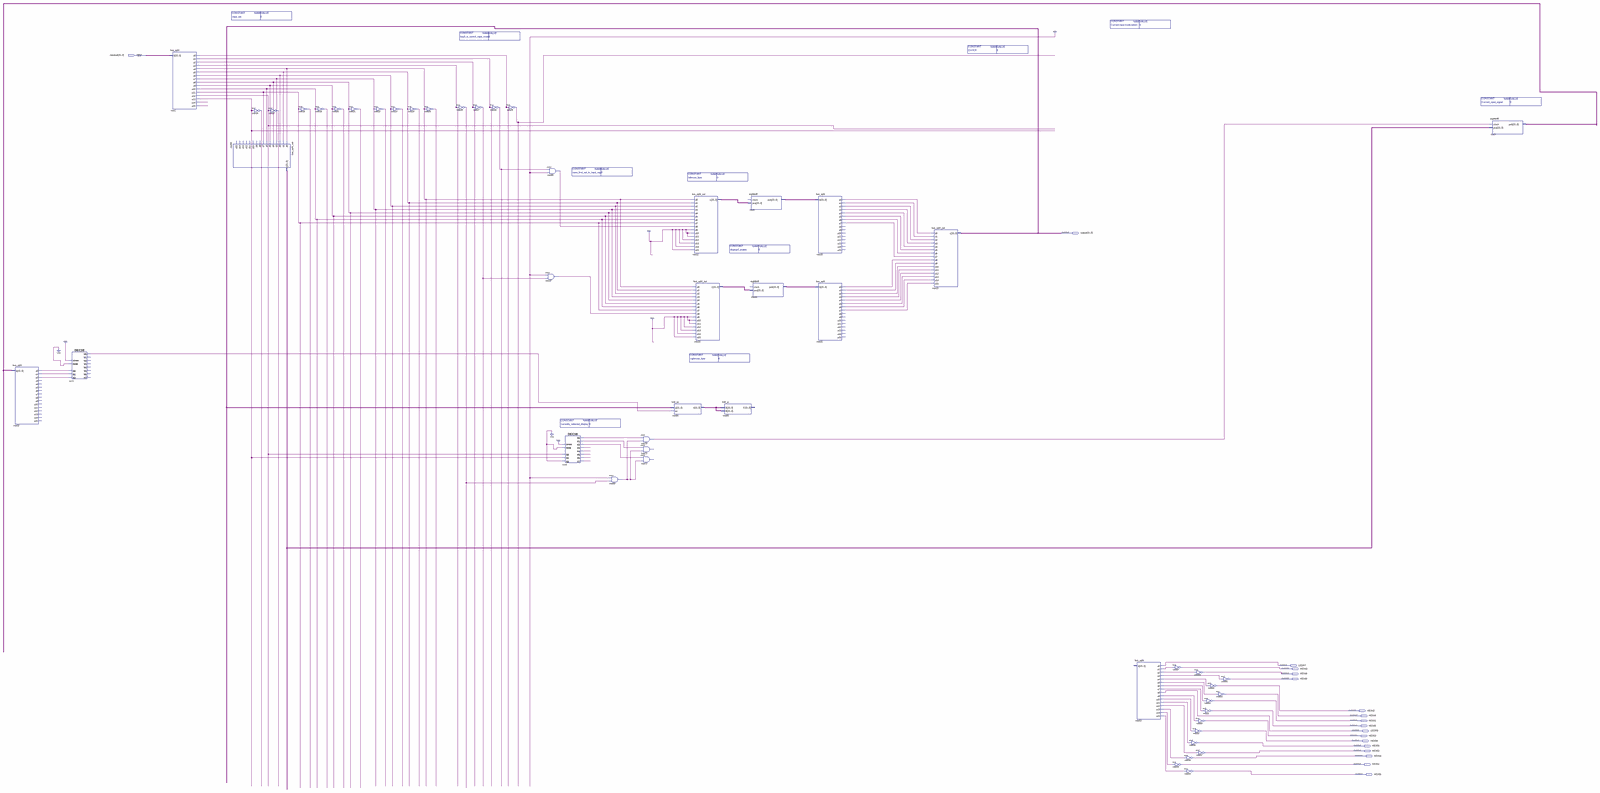
[diagram p0: schematic sheet, whole]
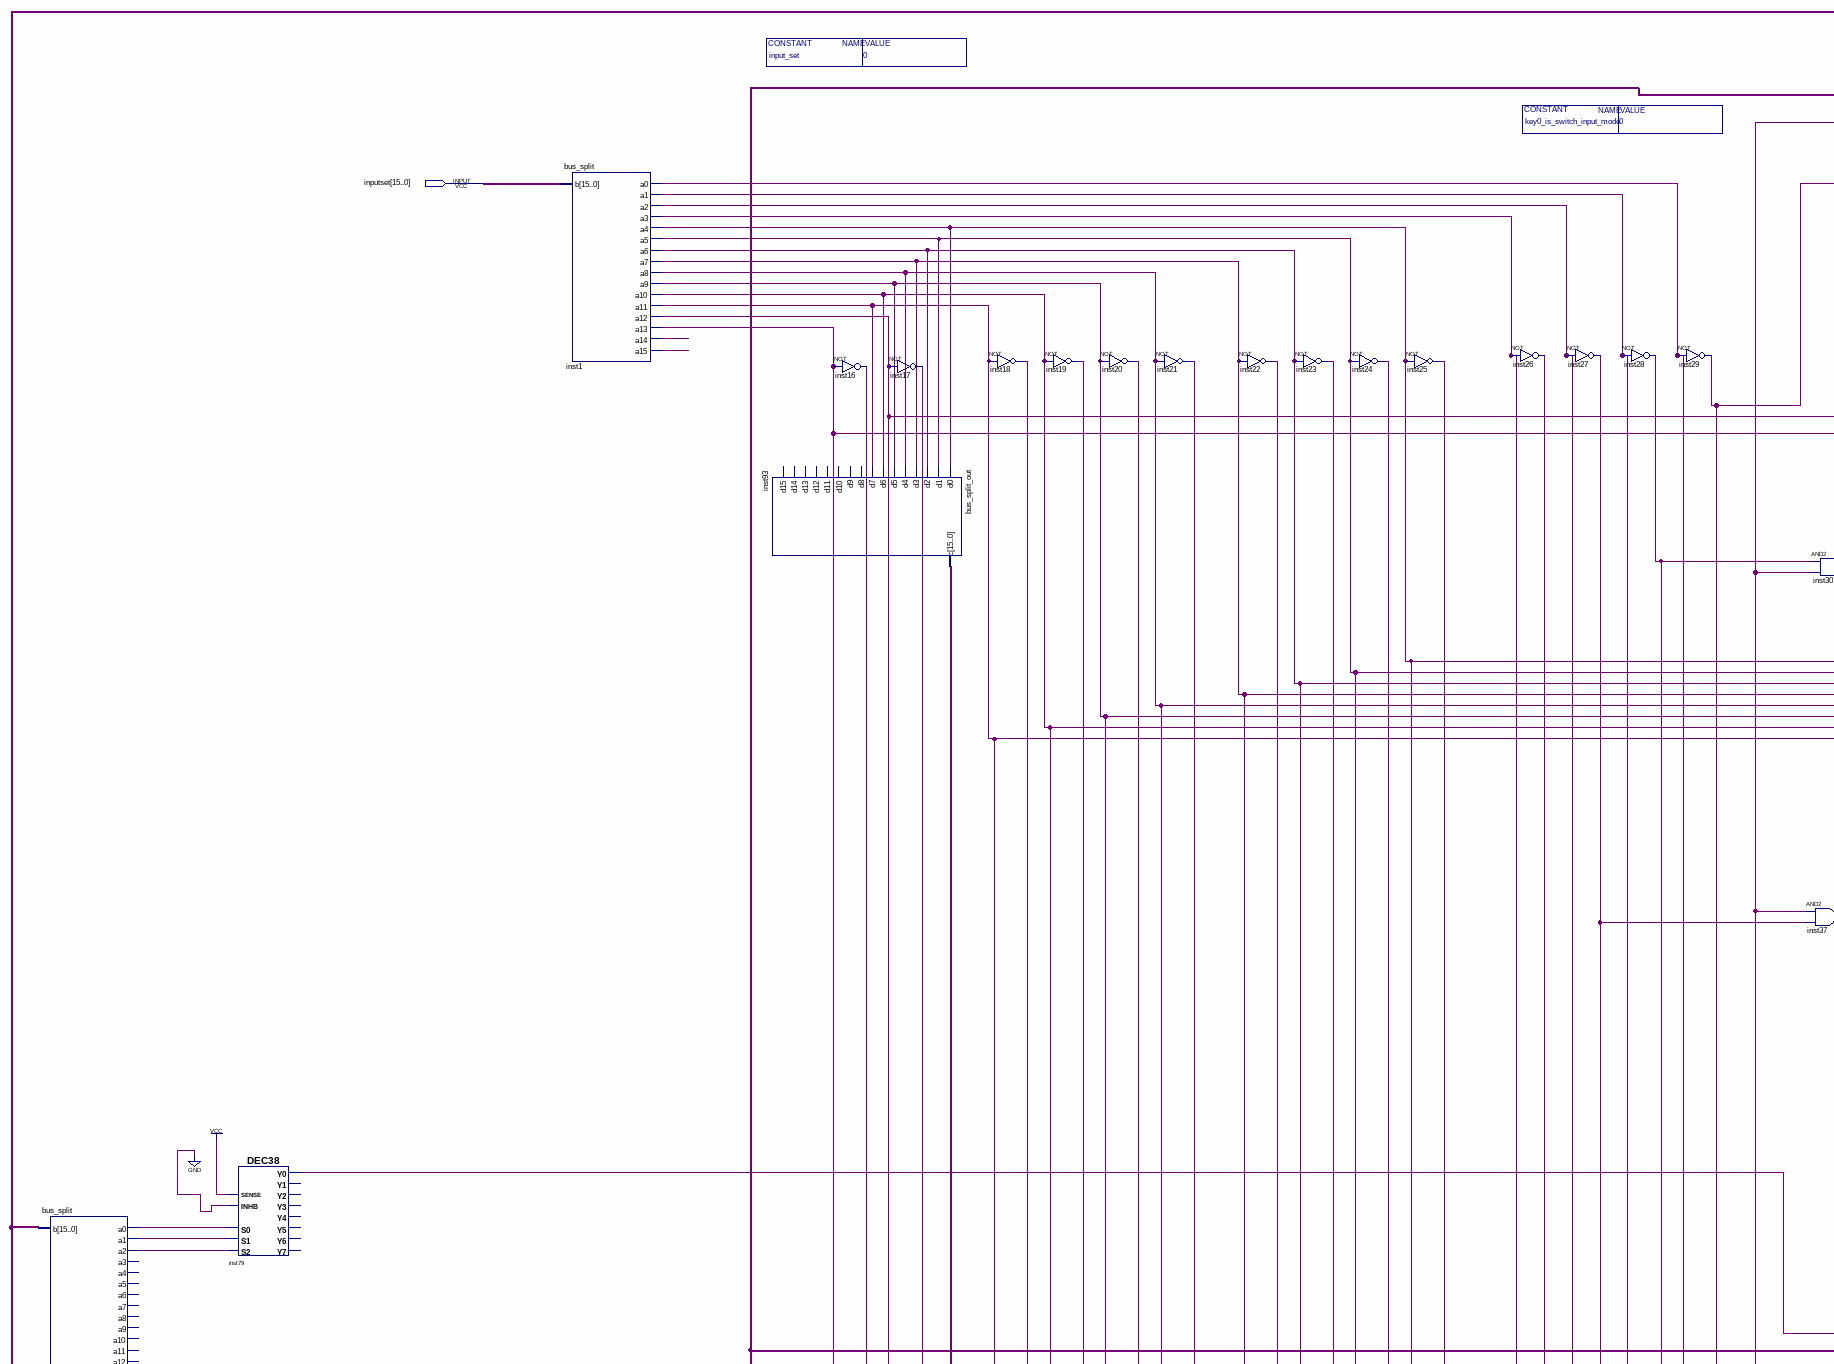
[diagram p1: schematic sheet, upper left part]
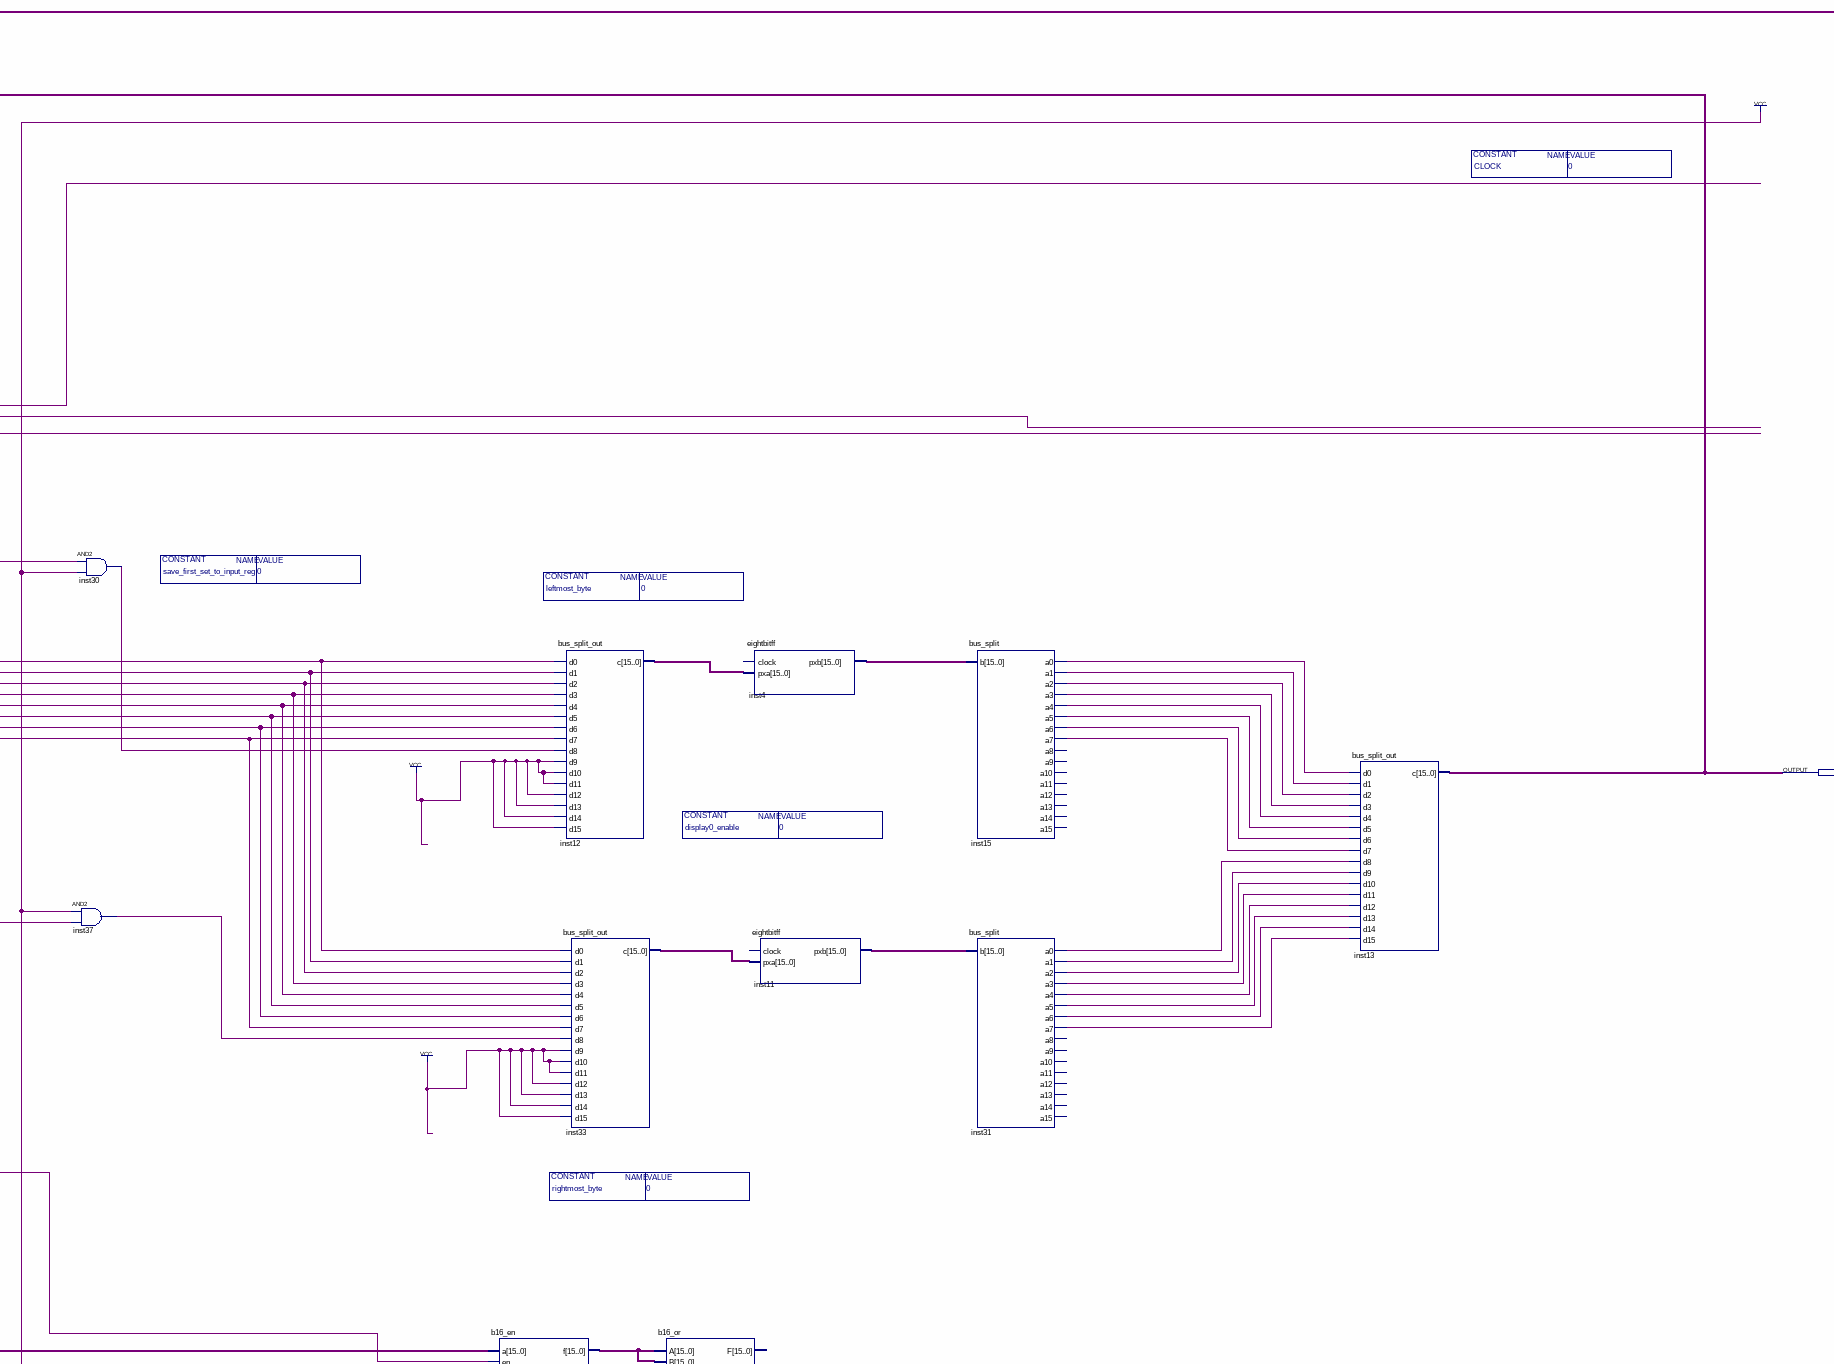
[diagram p2: schematic sheet, upper centre part]
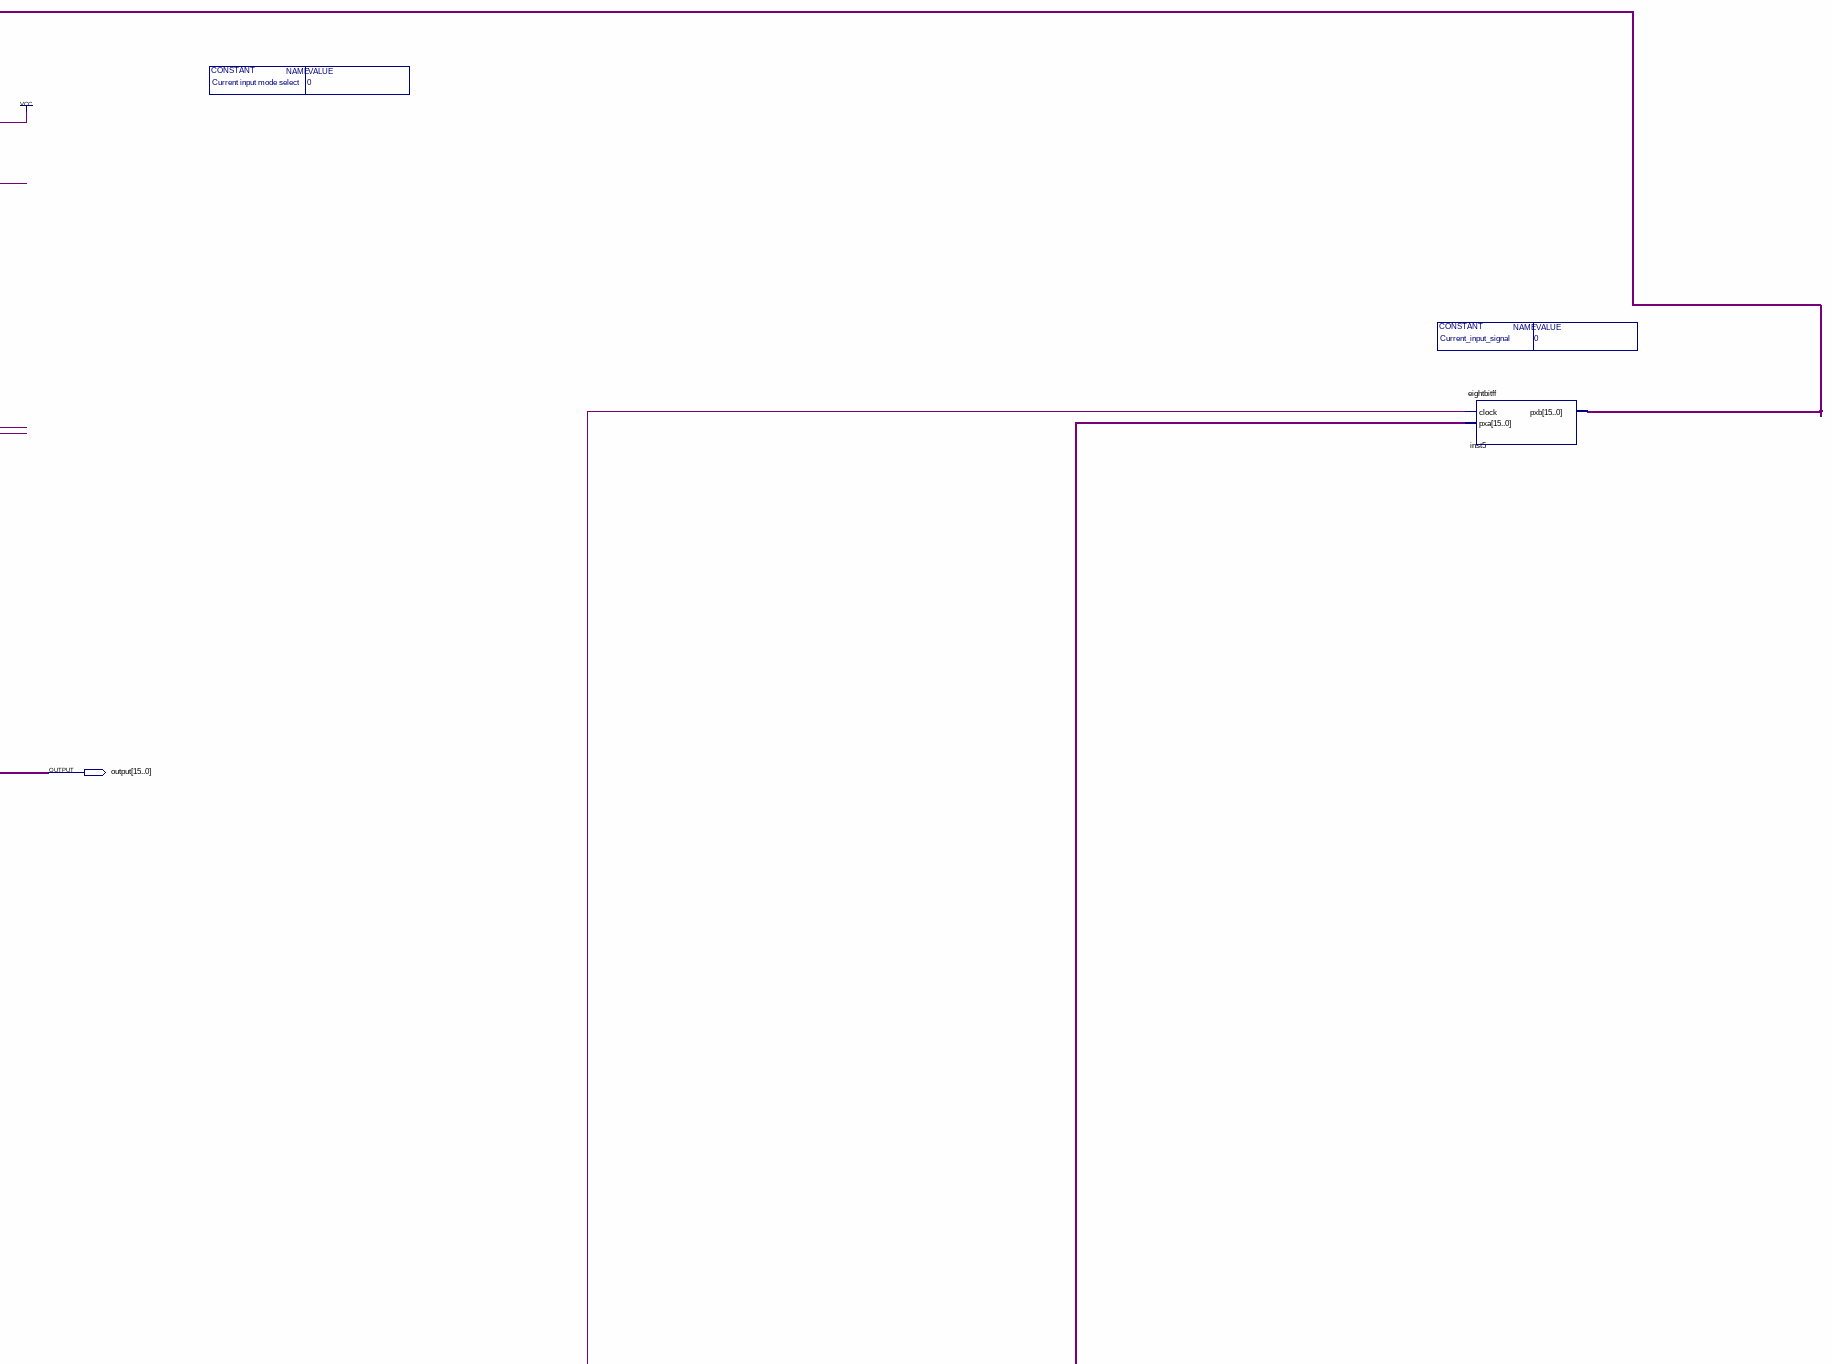
[diagram p3: schematic sheet, upper right part]
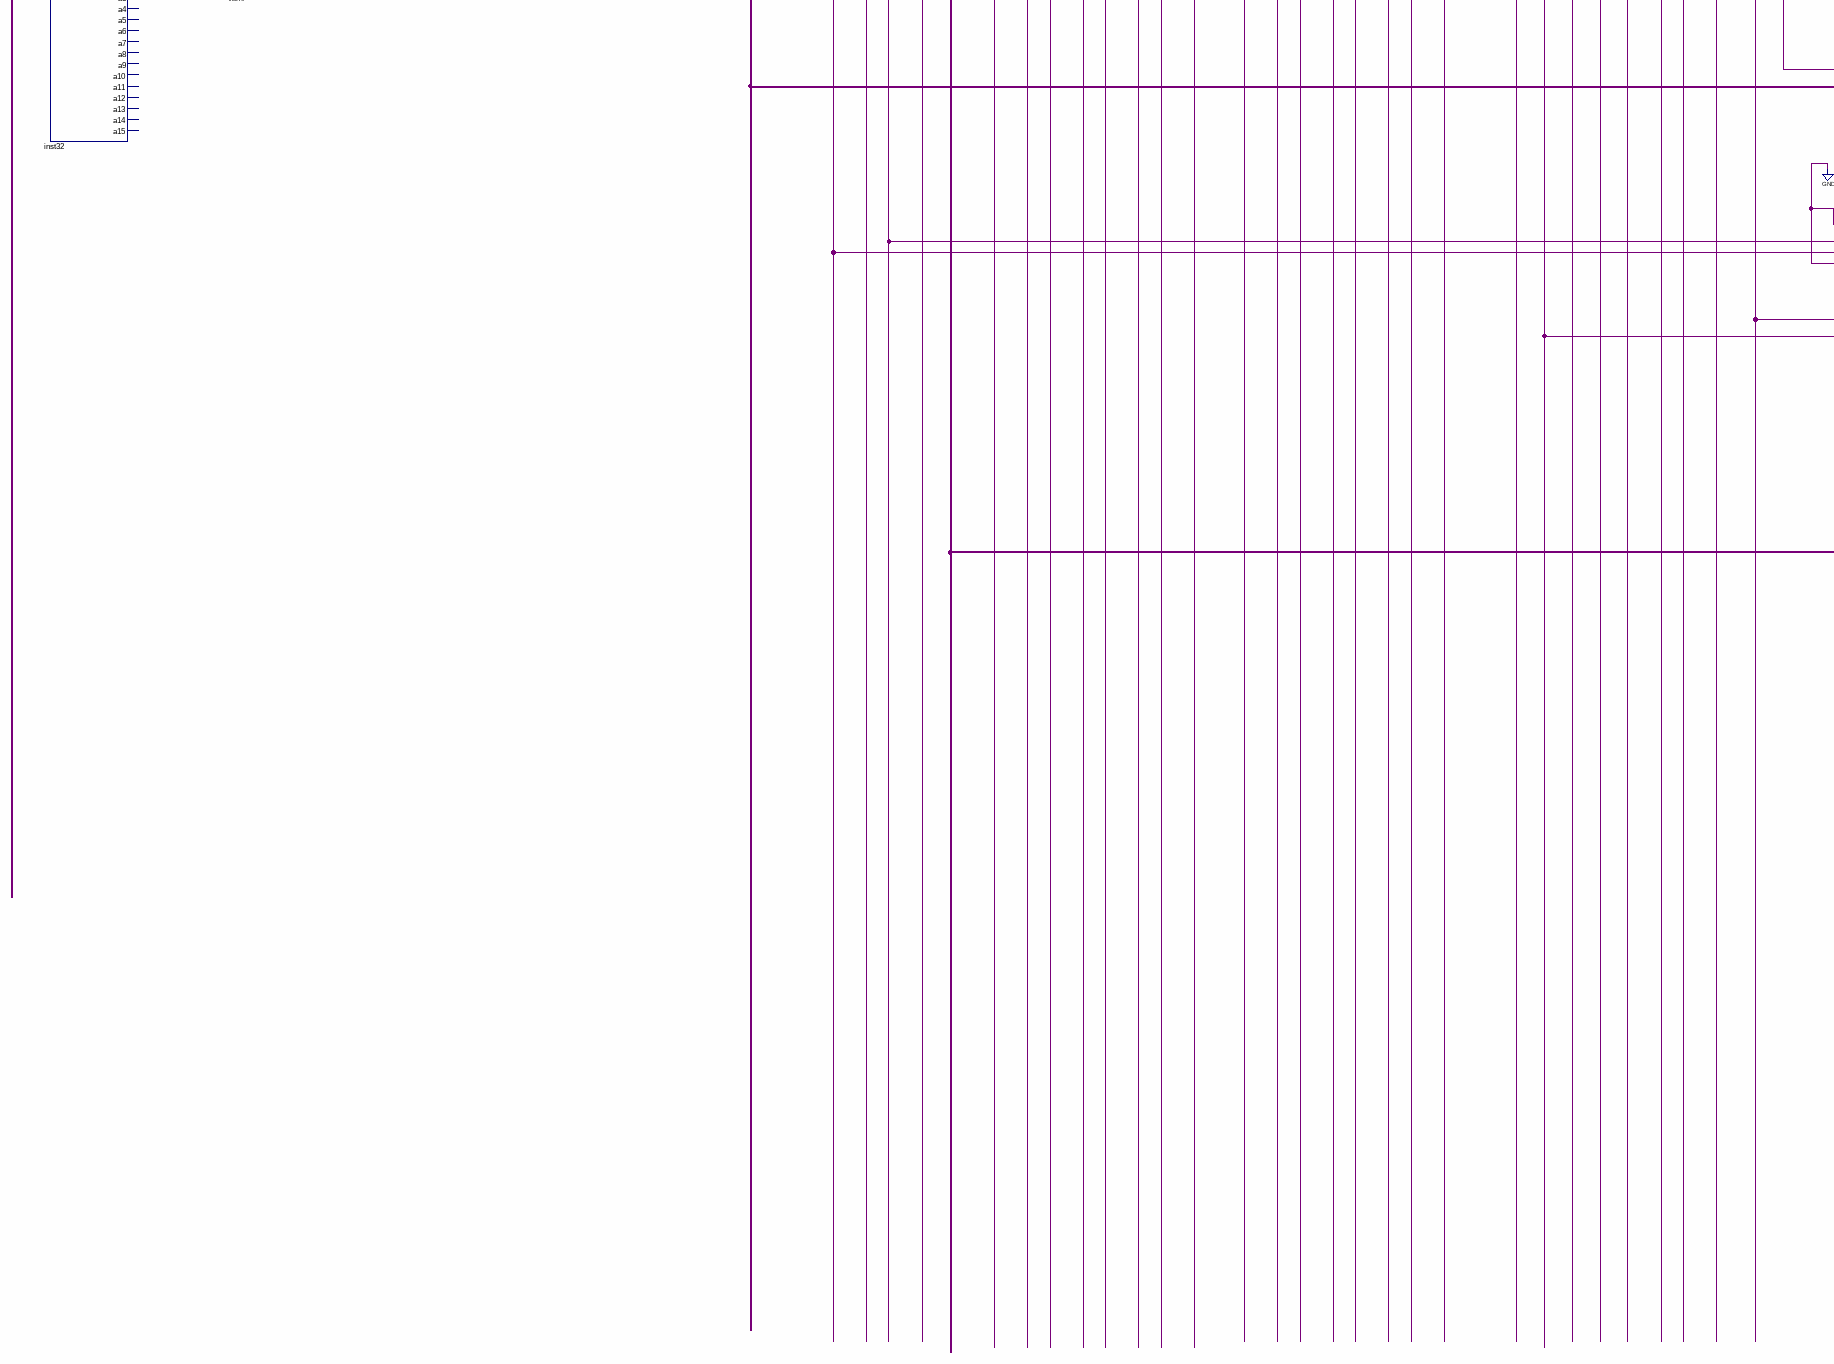
[diagram p4: schematic sheet, lower left part]
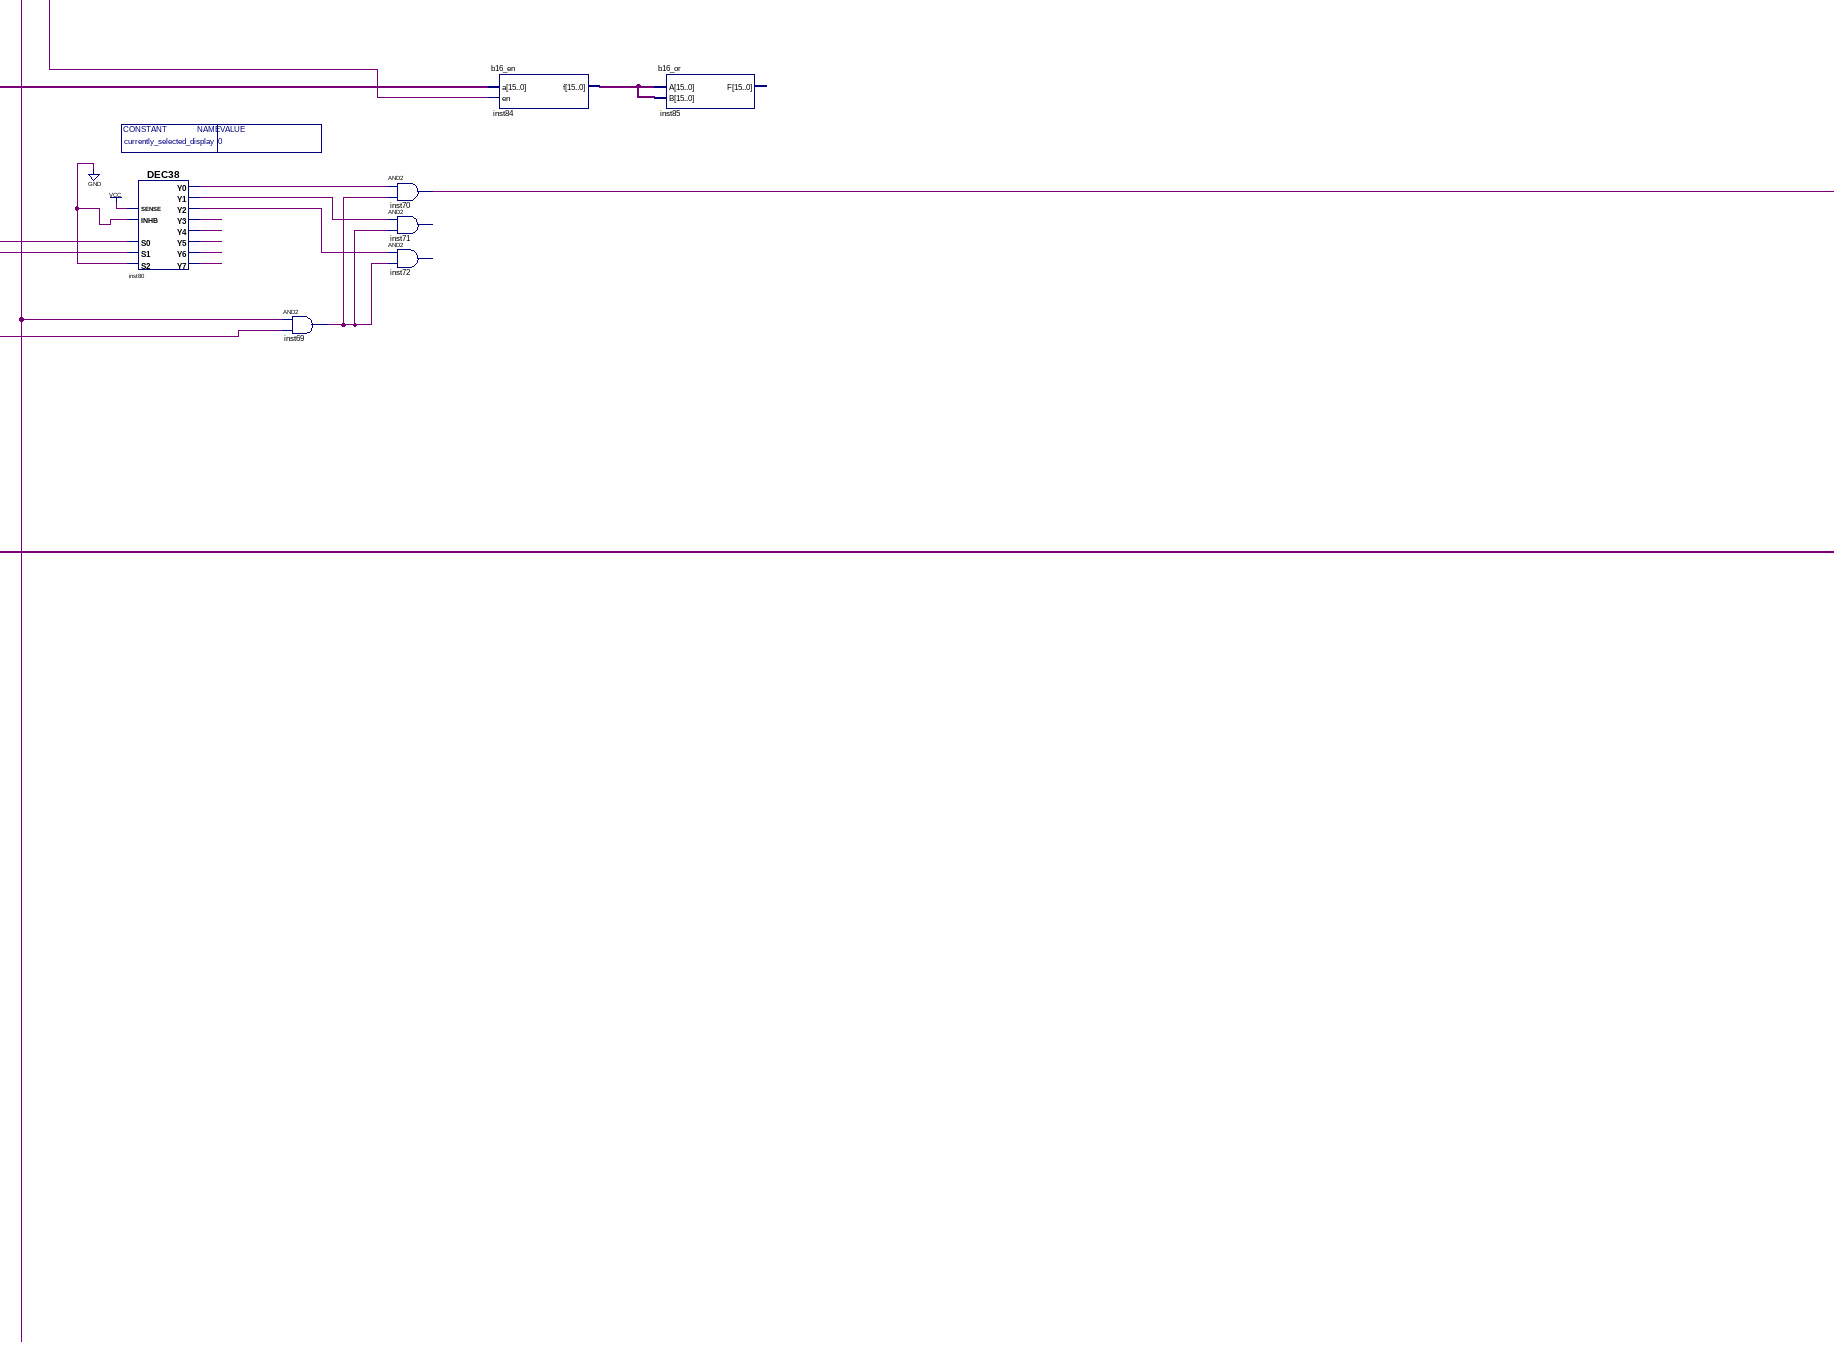
[diagram p5: schematic sheet, lower centre part]
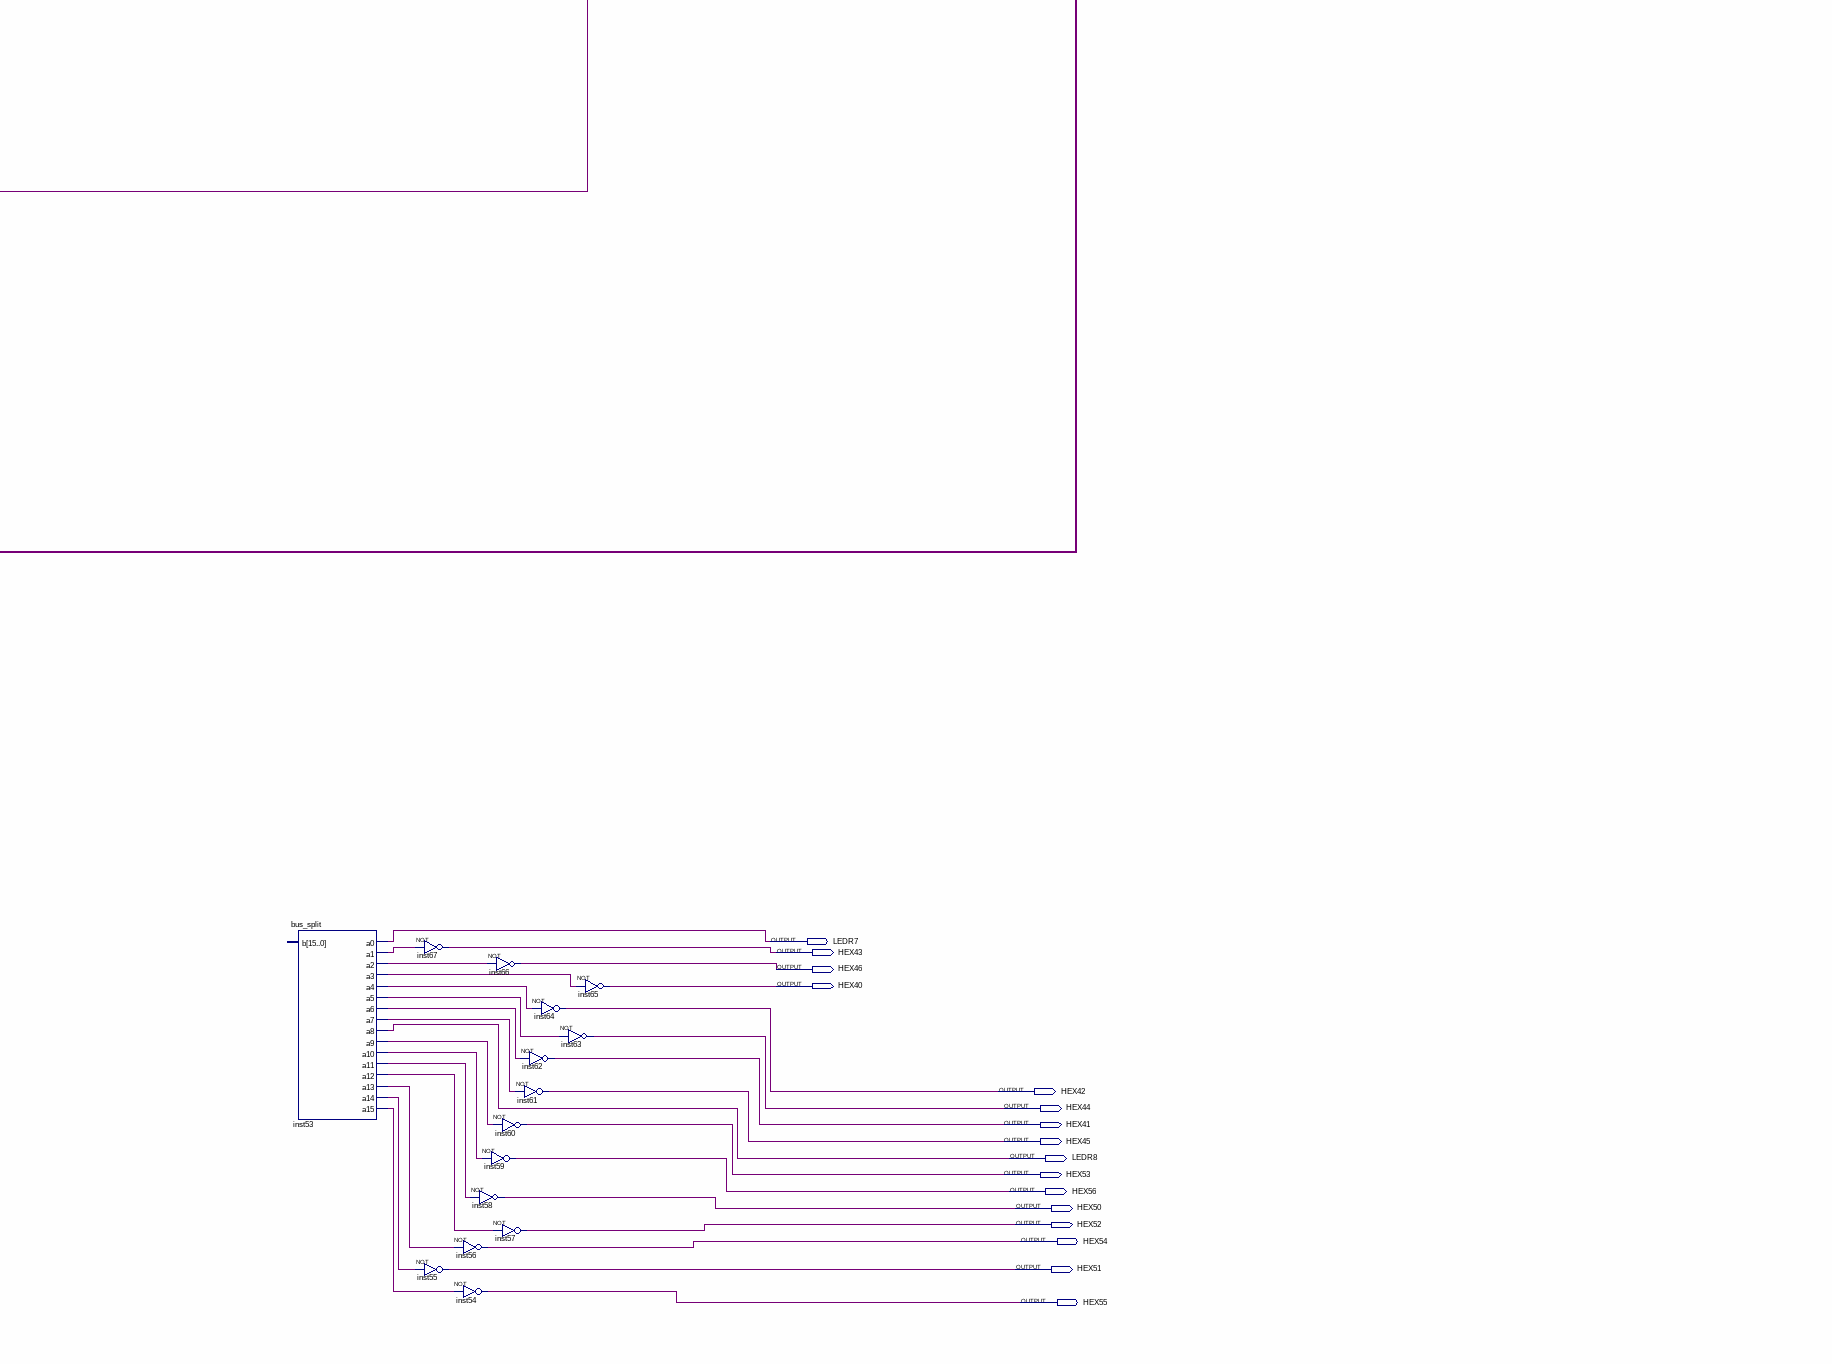
[diagram p6: schematic sheet, lower right part]
// Quartus schematic in_mod.bdf as structural Verilog: 50 symbols, 18 pins
module in_mod #(parameter \Current_input_mode_select  = 0, parameter CLOCK = 0, parameter key0_is_switch_input_mode = 0, parameter save_first_set_to_input_reg = 0, parameter leftmost_byte = 0, parameter rightmost_byte = 0, parameter display0_enable = 0, parameter input_set = 0, parameter Current_input_signal = 0, parameter currently_selected_display = 0) (
  input  [15:0] inputset,
  output [15:0] \output ,
  output LEDR7,
  output HEX43,
  output HEX46,
  output HEX40,
  output HEX42,
  output HEX44,
  output HEX41,
  output HEX45,
  output LEDR8,
  output HEX53,
  output HEX56,
  output HEX50,
  output HEX52,
  output HEX54,
  output HEX51,
  output HEX55
);

  wire inst1_a0, inst1_a1, inst1_a2, inst1_a3, inst1_a4, inst1_a5, inst1_a6, inst1_a7, inst1_a8, inst1_a9,
       inst1_a10, inst1_a11, inst1_a12, inst1_a13, inst1_a14, inst1_a15, inst15_a0, inst15_a1, inst15_a2,
       inst15_a3, inst15_a4, inst15_a5, inst15_a6, inst15_a7, inst16_out, inst17_out, inst18_out, inst19_out,
       inst20_out, inst21_out, inst22_out, inst23_out, inst24_out, inst25_out, inst26_out, inst27_out,
       inst28_out, inst29_out, inst30_out, inst31_a0, inst31_a1, inst31_a2, inst31_a3, inst31_a4, inst31_a5,
       inst31_a6, inst31_a7, inst32_a0, inst32_a1, inst32_a2, inst37_out, inst53_a1, inst53_a2, inst53_a3,
       inst53_a4, inst53_a5, inst53_a6, inst53_a7, inst53_a9, inst53_a10, inst53_a11, inst53_a12, inst53_a13,
       inst53_a14, inst53_a15, inst69_out, inst70_out, inst79_y0, inst80_y0, inst80_y1, inst80_y2, inst80_y3,
       inst80_y4, inst80_y5, inst80_y6, inst80_y7;
  wire [15:0] inst4_pxb, inst5_pxb, inst11_pxb, inst12_c, inst33_c, inst84_f, inst93_c;

  bus_split inst32 (
    .b(inst5_pxb), .a0(inst32_a0), .a1(inst32_a1), .a2(inst32_a2));  // open: a3, a4, a5, a6, a7, a8, a9, a10, a11, a12, a13, a14, a15
  DEC38 inst79 (
    .S2(inst32_a2), .S1(inst32_a1), .INHB(1'b0), .S0(inst32_a0), .SENSE(1'b1), .Y0(inst79_y0));  // open: Y7, Y6, Y5, Y3, Y4, Y1, Y2
  bus_split inst1 (
    .b(inputset), .a0(inst1_a0), .a1(inst1_a1), .a2(inst1_a2), .a3(inst1_a3), .a4(inst1_a4), .a5(inst1_a5),
    .a6(inst1_a6), .a7(inst1_a7), .a8(inst1_a8), .a9(inst1_a9), .a10(inst1_a10), .a11(inst1_a11),
    .a12(inst1_a12), .a13(inst1_a13), .a14(inst1_a14), .a15(inst1_a15));
  bus_split_out inst93 (
    .d0(inst1_a4), .d1(inst1_a5), .d2(inst1_a6), .d3(inst1_a7), .d4(inst1_a8), .d5(inst1_a9), .d6(inst1_a10),
    .d7(inst1_a11), .c(inst93_c));  // open: d8, d9, d10, d11, d12, d13, d14, d15
  not inst16 (inst16_out, inst1_a13);
  not inst17 (inst17_out, inst1_a12);
  not inst18 (inst18_out, inst1_a11);
  not inst19 (inst19_out, inst1_a10);
  not inst20 (inst20_out, inst1_a9);
  not inst21 (inst21_out, inst1_a8);
  not inst22 (inst22_out, inst1_a7);
  not inst23 (inst23_out, inst1_a6);
  not inst24 (inst24_out, inst1_a5);
  not inst25 (inst25_out, inst1_a4);
  not inst26 (inst26_out, inst1_a3);
  not inst27 (inst27_out, inst1_a2);
  not inst28 (inst28_out, inst1_a1);
  not inst29 (inst29_out, inst1_a0);
  and inst37 (inst37_out, 1'b1, inst27_out);
  and inst30 (inst30_out, inst28_out, 1'b1);
  DEC38 inst80 (
    .S2(1'b0), .S1(inst1_a13), .INHB(1'b0), .S0(inst1_a12), .SENSE(1'b1), .Y7(inst80_y7), .Y6(inst80_y6),
    .Y5(inst80_y5), .Y3(inst80_y3), .Y4(inst80_y4), .Y0(inst80_y0), .Y1(inst80_y1), .Y2(inst80_y2));
  and inst69 (inst69_out, 1'b1, inst26_out);
  and inst70 (inst70_out, inst80_y0, inst69_out);
  // AND2 inst71 has open pins: IN1=inst80_y1, IN2=inst69_out, OUT=open
  // AND2 inst72 has open pins: IN1=inst80_y2, IN2=inst69_out, OUT=open
  b16_en inst84 (.a(\output ), .en(inst79_y0), .f(inst84_f));
  bus_split_out inst12 (
    .d0(inst1_a4), .d1(inst1_a5), .d2(inst1_a6), .d3(inst1_a7), .d4(inst1_a8), .d5(inst1_a9), .d6(inst1_a10),
    .d7(inst1_a11), .d8(inst30_out), .d9(1'b1), .d10(1'b1), .d11(1'b1), .d12(1'b1), .d13(1'b1), .d14(1'b1),
    .d15(1'b1), .c(inst12_c));
  bus_split_out inst33 (
    .d0(inst1_a4), .d1(inst1_a5), .d2(inst1_a6), .d3(inst1_a7), .d4(inst1_a8), .d5(inst1_a9), .d6(inst1_a10),
    .d7(inst1_a11), .d8(inst37_out), .d9(1'b1), .d10(1'b1), .d11(1'b1), .d12(1'b1), .d13(1'b1), .d14(1'b1),
    .d15(1'b1), .c(inst33_c));
  b16_or inst85 (.A(inst84_f), .B(inst84_f));  // open: F
  eightbitff inst4 (.pxa(inst12_c), .pxb(inst4_pxb));  // open: clock
  eightbitff inst11 (.pxa(inst33_c), .pxb(inst11_pxb));  // open: clock
  bus_split inst15 (
    .b(inst4_pxb), .a0(inst15_a0), .a1(inst15_a1), .a2(inst15_a2), .a3(inst15_a3), .a4(inst15_a4),
    .a5(inst15_a5), .a6(inst15_a6), .a7(inst15_a7));  // open: a8, a9, a10, a11, a12, a13, a14, a15
  bus_split inst31 (
    .b(inst11_pxb), .a0(inst31_a0), .a1(inst31_a1), .a2(inst31_a2), .a3(inst31_a3), .a4(inst31_a4),
    .a5(inst31_a5), .a6(inst31_a6), .a7(inst31_a7));  // open: a8, a9, a10, a11, a12, a13, a14, a15
  bus_split_out inst13 (
    .d0(inst15_a0), .d1(inst15_a1), .d2(inst15_a2), .d3(inst15_a3), .d4(inst15_a4), .d5(inst15_a5),
    .d6(inst15_a6), .d7(inst15_a7), .d8(inst31_a0), .d9(inst31_a1), .d10(inst31_a2), .d11(inst31_a3),
    .d12(inst31_a4), .d13(inst31_a5), .d14(inst31_a6), .d15(inst31_a7), .c(\output ));
  bus_split inst53 (
    .a0(LEDR7), .a1(inst53_a1), .a2(inst53_a2), .a3(inst53_a3), .a4(inst53_a4), .a5(inst53_a5),
    .a6(inst53_a6), .a7(inst53_a7), .a8(LEDR8), .a9(inst53_a9), .a10(inst53_a10), .a11(inst53_a11),
    .a12(inst53_a12), .a13(inst53_a13), .a14(inst53_a14), .a15(inst53_a15));  // open: b
  not inst67 (HEX43, inst53_a1);
  not inst55 (HEX51, inst53_a14);
  not inst58 (HEX50, inst53_a11);
  not inst56 (HEX54, inst53_a13);
  not inst54 (HEX55, inst53_a15);
  not inst66 (HEX46, inst53_a2);
  not inst61 (HEX45, inst53_a7);
  not inst60 (HEX53, inst53_a9);
  not inst59 (HEX56, inst53_a10);
  not inst57 (HEX52, inst53_a12);
  not inst64 (HEX42, inst53_a4);
  not inst63 (HEX44, inst53_a5);
  not inst62 (HEX41, inst53_a6);
  not inst65 (HEX40, inst53_a3);
  eightbitff inst5 (.clock(inst70_out), .pxa(inst93_c), .pxb(inst5_pxb));
endmodule
